# Altium schematic sheet Ground scheme(coming out of NFETS).SchDoc
size A4
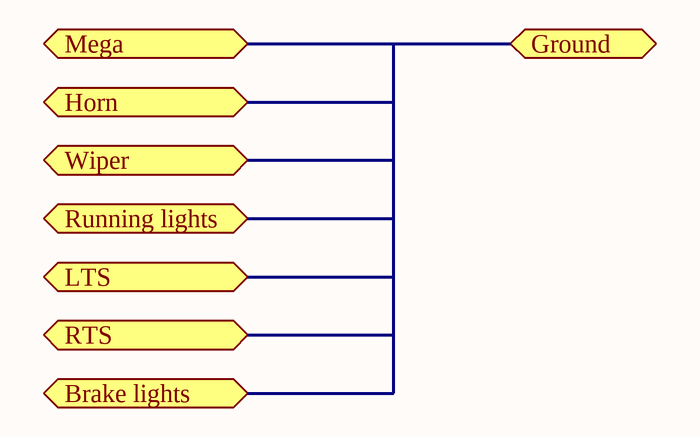
[diagram p0: Ground scheme(coming out of NFETS).SchDoc]

## Ports
Brake lights, Ground, Horn, LTS, Mega, RTS, Running lights, Wiper

## Nets
Ground: port Mega, port Ground